# EAGLE design IRBlaster (EAGLE 8.4.1)
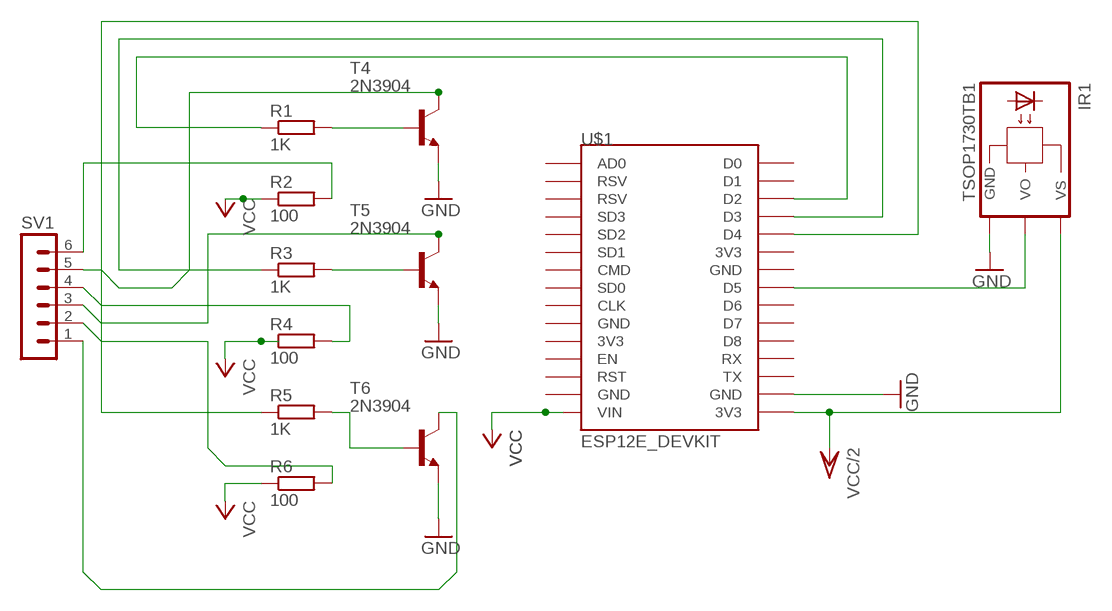
[diagram p0: schematic, sheet 1]

## Parts
IR1  TSOP1730TB1  [TSOP17_TB1]
R1  1K  R-EU_0207/10  [0207/10]
R2  100  R-EU_0207/10  [0207/10]
R3  1K  R-EU_0207/10  [0207/10]
R4  100  R-EU_0207/10  [0207/10]
R5  1K  R-EU_0207/10  [0207/10]
R6  100  R-EU_0207/10  [0207/10]
SV1  MA06-1  [MA06-1]
T4  2N3904  [TO92]
T5  2N3904  [TO92]
T6  2N3904  [TO92]
U$1  ESP12E_DEVKIT  [ESP12E_DEVKIT]

## Nets
GND: IR1.GND T4.3(E) T5.3(E) T6.3(E) U$1.GND@3(GND)
N$1: IR1.VO U$1.D5
N$2: R1.2 T4.2(B)
N$3: R3.2 T5.2(B)
N$4: R5.2 T6.2(B)
N$5: R4.2 SV1.4
N$6: R2.2 SV1.6
N$8: R1.1 U$1.D2
N$9: SV1.5 T4.1(C)
N$10: R3.1 U$1.D3
N$11: SV1.3 T5.1(C)
N$12: R5.1 R6.2 SV1.2 U$1.D4
N$14: SV1.1 T6.1(C)
VCC: R2.1 R4.1 R6.1 U$1.VIN
VCC/2: IR1.VS U$1.3V3@2(3V3)
Unconnected: U$1.3V3@0(3V3) U$1.3V3@1(3V3) U$1.AD0 U$1.CLK U$1.CMD U$1.D0 U$1.D1 U$1.D6 U$1.D7 U$1.D8 U$1.EN U$1.GND@0(GND) U$1.GND@1(GND) U$1.GND@2(GND) U$1.RST U$1.RSV@0(RSV) U$1.RSV@1(RSV) U$1.RX U$1.SD0 U$1.SD1 U$1.SD2 U$1.SD3 U$1.TX

## Library data of the parts
IR1 = telefunken:TSOP17*TB1: TSOP17..TB1 IR Receiver Modules for Remote Control Systems Source: http://www.vishay.com/docs/82042/82042.pdf; OC_FARNELL: unknown; OC_NEWARK: unknown
R1-R6 = resistor:R-EU_: RESISTOR, European symbol
SV1 = con-lstb:MA06-1: PIN HEADER; OC_FARNELL: unknown; OC_NEWARK: unknown
T4-T6 = transistor:2N3904: NPN TRANSISTOR
U$1 = ESP12E_DEVKIT:ESP12E_DEVKIT: ESP12E DEVKIT BOARD

## Board
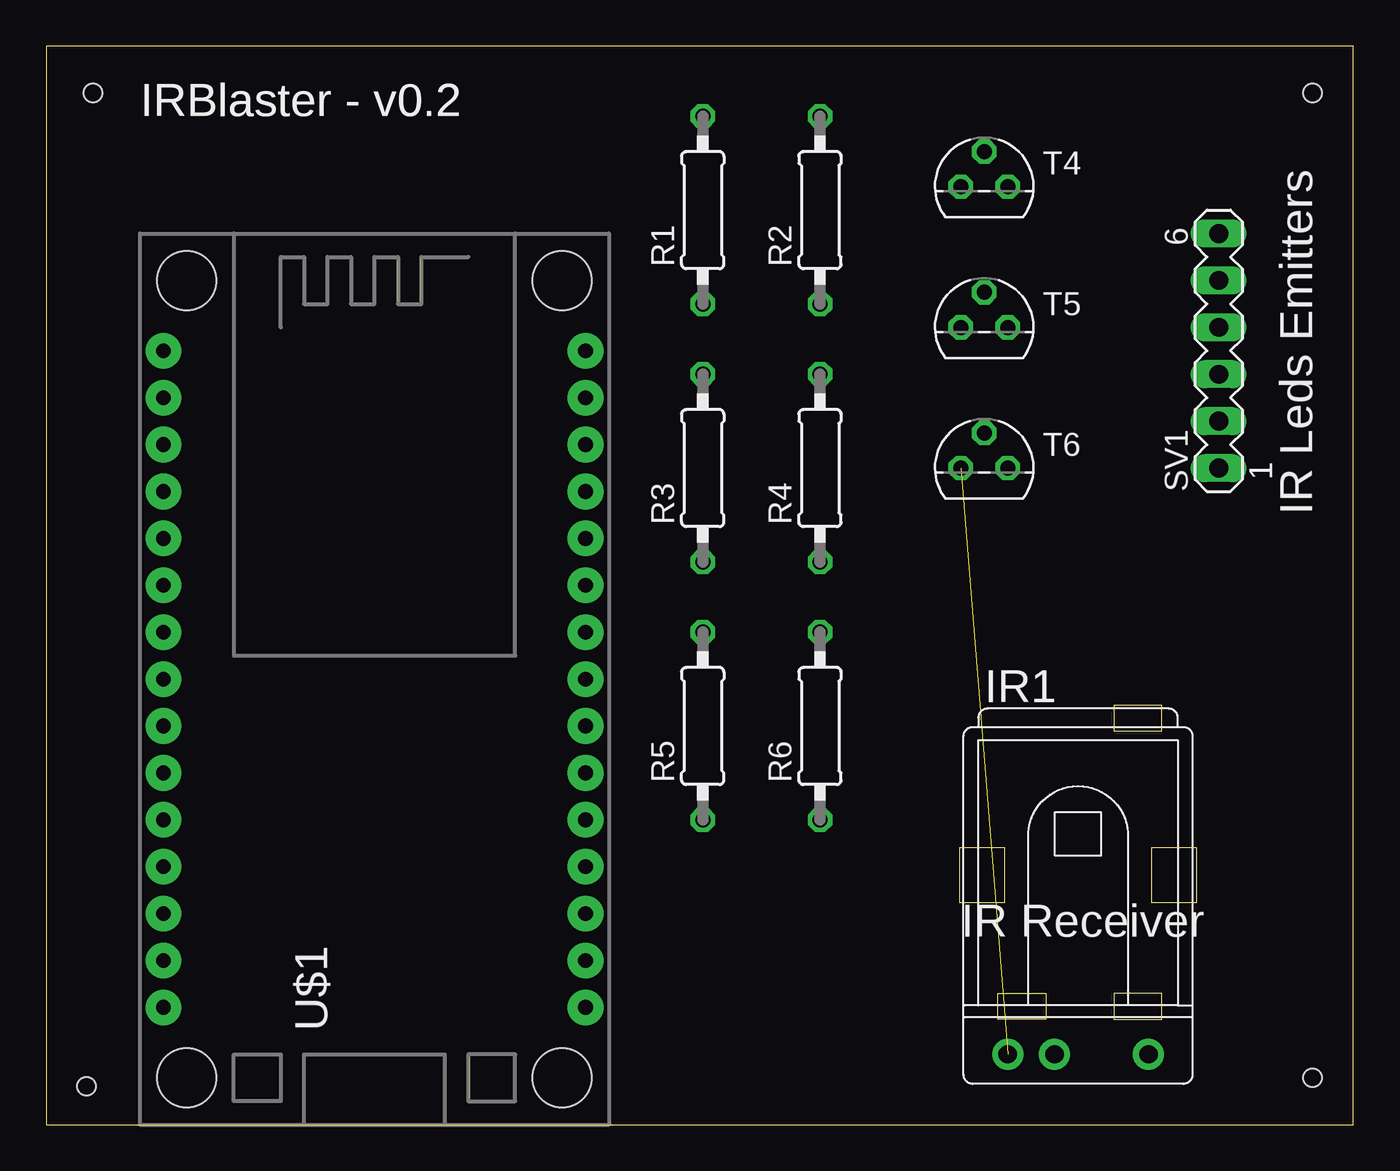
[diagram p1: board, top side]
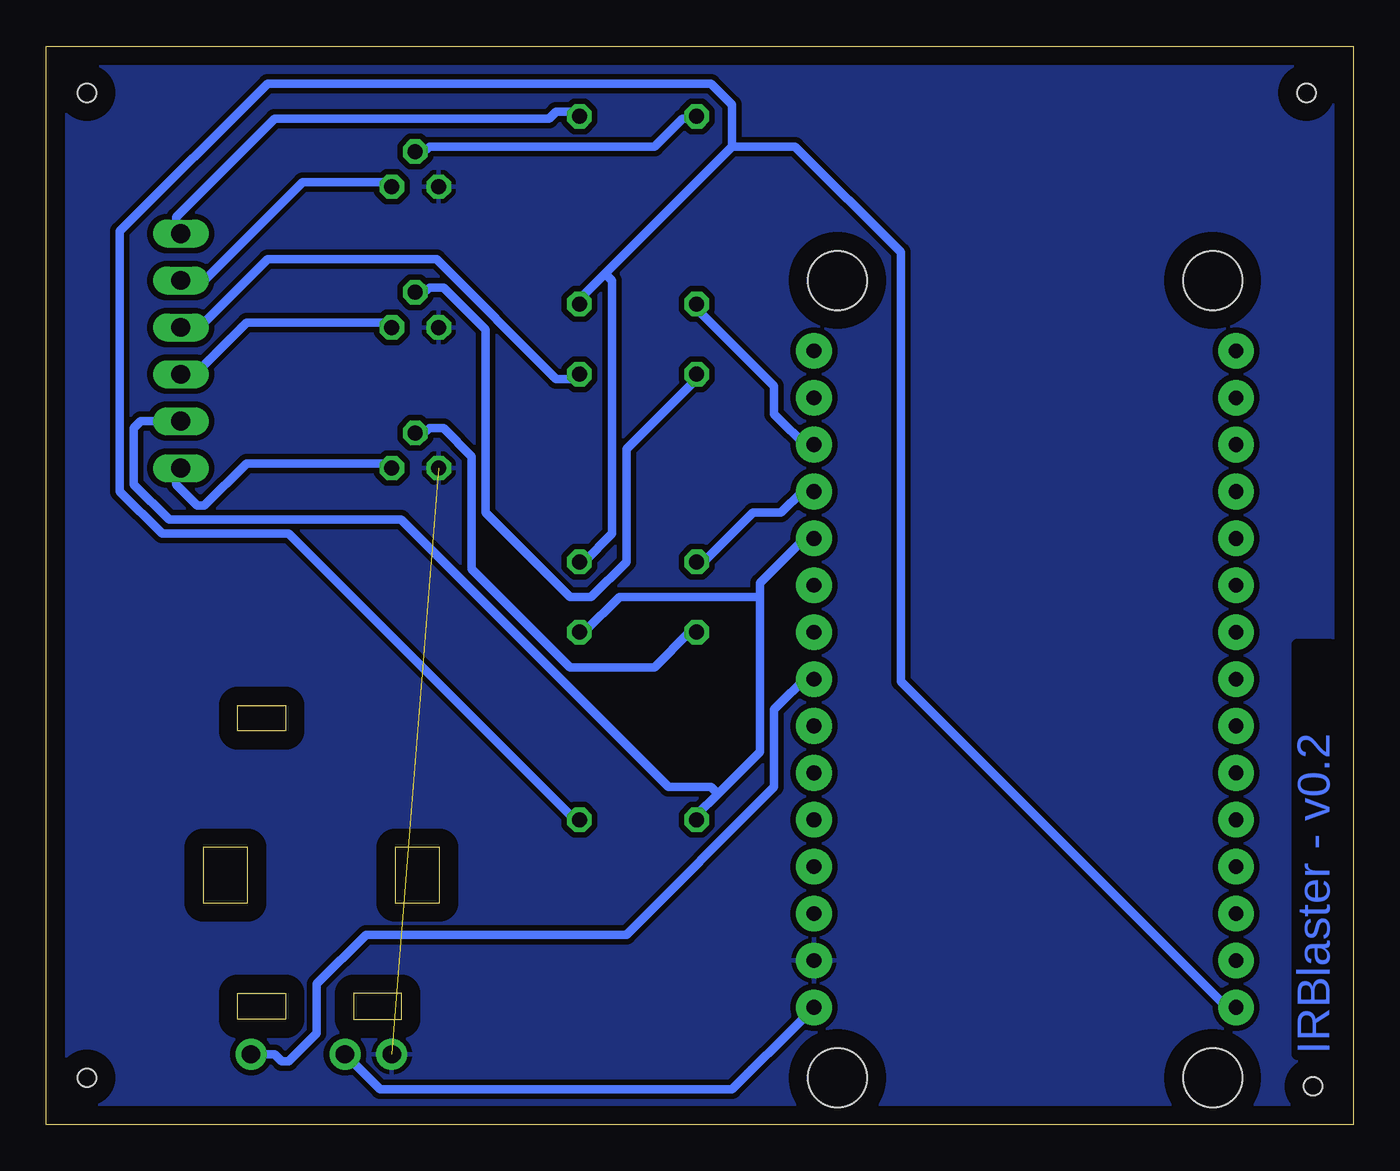
[diagram p2: board, bottom side, seen from below]

Size 70.79 x 58.41 mm. Coordinates in mm from the lower left corner, seen from the top.
Outline: 0,0 70.79,0 70.79,58.41 0,58.41 0,0
Copper layers (1*16): Top 0.035mm / dielectric 1.5mm / Bottom 0.035mm
Design rules "default *": minimum track width 18mil, minimum drill 0.6mm, track to track 12mil, track to pad 12mil, pad to pad 6mil, via to via 6mil, smd to smd 6mil, copper to edge 40mil, drill to drill 6mil, minimum pad ring 10mil, minimum via ring 8mil, stop-mask expansion 4mil, vias tented up to drill 0mil, thermal gap 10mil
Holes 1 mm at 2.54,55.88 68.58,55.88 68.58,2.54 2.18,2.08

### Footprints (pad centres in the part's own frame; a part is rotated, then mirrored left to right if it is on the bottom)
TSOP17_TB1 = drill 1 pad 1.676: GND 0,-3.81; VO 0,3.81; VS 0,-1.27
0207/10 = drill 0.813 octagon: 1 -5.08,0; 2 5.08,0
MA06-1 = drill 1.016 long: 1 -6.35,0; 2 -3.81,0; 3 -1.27,0; 4 1.27,0; 5 3.81,0; 6 6.35,0
TO92 = drill 0.813 octagon: 1 1.27,0; 2 0,1.905; 3 -1.27,0
ESP12E_DEVKIT = drill 0.8 pad 1.93: 3V3@0 -11.43,-7.62; 3V3@1 11.43,5.08; 3V3@2 11.43,-17.78; AD0 -11.43,17.78; CLK -11.43,-2.54; CMD -11.43,2.54; D0 11.43,17.78; D1 11.43,15.24; D2 11.43,12.7; D3 11.43,10.16; D4 11.43,7.62; D5 11.43,0; D6 11.43,-2.54; D7 11.43,-5.08; D8 11.43,-7.62; EN -11.43,-10.16; GND@0 -11.43,-5.08; GND@1 -11.43,-15.24; GND@2 11.43,2.54; GND@3 11.43,-15.24; RST -11.43,-12.7; RSV@0 -11.43,15.24; RSV@1 -11.43,12.7; RX 11.43,-10.16; SD0 -11.43,0; SD1 -11.43,5.08; SD2 -11.43,7.62; SD3 -11.43,10.16; TX 11.43,-12.7; VIN -11.43,-17.78 | hole 3.2: -10.16,21.59; 10.16,21.59; 10.16,-21.59; -10.16,-21.59

### Placement (x,y rotation side)
IR1  55.88,3.81 270 top
R1  35.56,49.53 90 top
R2  41.91,49.53 90 top
R3  35.56,35.56 90 top
R4  41.91,35.56 90 top
R5  35.56,21.59 90 top
R6  41.91,21.59 90 top
SV1  63.5,41.91 90 top
T4  50.8,50.8 0 top
T5  50.8,43.18 0 top
T6  50.8,35.56 0 top
U$1  17.78,24.13 0 top

### Tracks (layer width: path | path; a pad name or v marks a point on that pad's centre or on a via)
GND  (1 unrouted)
  pour Bottom: 0,58.42 0,0 71.12,0 71.12,58.42
N$1
  Bottom 0.457: IR1.VO 58.42,3.81 58.04,3.43 57.66,3.43 56.13,4.95 56.13,7.62 53.47,10.29 39.37,10.29 31.37,18.29 31.37,22.48 29.46,24.38 U$1.D5
N$2
  Bottom 0.457: R1.2 35.56,54.48 36.32,54.48 37.85,52.96 50.04,52.96 50.42,52.58 50.8,52.58 T4.2
N$3
  Bottom 0.457: R3.2 35.56,40.39 39.37,36.58 39.37,30.48 41.27,28.57 42.42,28.57 46.99,33.15 46.99,43.05 49.28,45.34 50.04,45.34 50.42,44.96 50.8,44.96 T5.2
N$4
  Bottom 0.457: R5.2 35.94,26.67 37.85,24.77 42.42,24.77 47.75,30.1 47.75,36.2 49.28,37.72 50.04,37.72 50.42,37.34 50.8,37.34 T6.2
N$5
  Bottom 0.457: R4.2 42.04,40.39 43.18,40.39 49.66,46.86 58.8,46.86 62.23,43.43 63.37,43.43 SV1.4
N$6
  Bottom 0.457: R2.2 42.04,54.86 43.18,54.86 43.56,54.48 58.42,54.48 63.75,49.15 63.75,48.39 SV1.6
N$8
  Bottom 0.457: R1.1 35.56,44.2 31.37,40.01 31.37,38.48 29.46,36.58 U$1.D2
N$9
  Bottom 0.457: SV1.5 62.23,45.72 56.9,51.05 52.32,51.05 T4.1
N$10
  Bottom 0.457: R3.1 35.18,30.48 32.51,33.15 30.99,33.15 29.84,34.29 U$1.D3
N$11
  Bottom 0.457: T5.1 52.32,43.43 59.94,43.43 62.61,40.77 63.37,40.77 SV1.3
N$12
  Bottom 0.457: 34.42,17.91 32.13,20.19 32.13,28.57 | 34.42,17.91 35.56,16.76 R5.1 | 32.13,28.57 32.13,29.34 29.46,32 U$1.D4 | 32.13,28.57 39.75,28.57 41.66,26.67 R6.2 | SV1.2 65.66,38.1 66.04,37.72 66.04,34.67 64.14,32.77 51.56,32.77 37.08,18.29 34.8,18.29 34.42,17.91
N$14
  Bottom 0.457: T6.1 52.32,35.81 59.94,35.81 62.23,33.53 62.61,33.53 63.75,34.67 63.75,35.43 SV1.1
VCC
  Bottom 0.457: 33.66,52.96 33.66,55.24 34.8,56.39 58.8,56.39 66.8,48.39 66.8,34.29 64.52,32 57.66,32 42.42,16.76 42.04,16.76 R6.1 | 40.51,46.1 42.04,44.58 R2.1 | 40.51,46.1 33.66,52.96 | 40.51,46.1 40.13,45.72 40.13,32 41.66,30.48 R4.1 | 33.66,52.96 30.23,52.96 24.51,47.24 24.51,24 6.98,6.48 6.6,6.48 U$1.VIN
VCC/2
  Bottom 0.457: IR1.VS 52.7,1.91 33.66,1.91 29.84,5.71 29.46,5.71 29.08,6.1 U$1.3V3@2

### Text on the board
Bottom: IRBlaster - v0.2
tNames: IRBlaster - v0.2 | IRBlaster - v0.2 | IR Leds Emitters | IR Receiver